# EAGLE schematic Esquema (EAGLE 9.2.2)
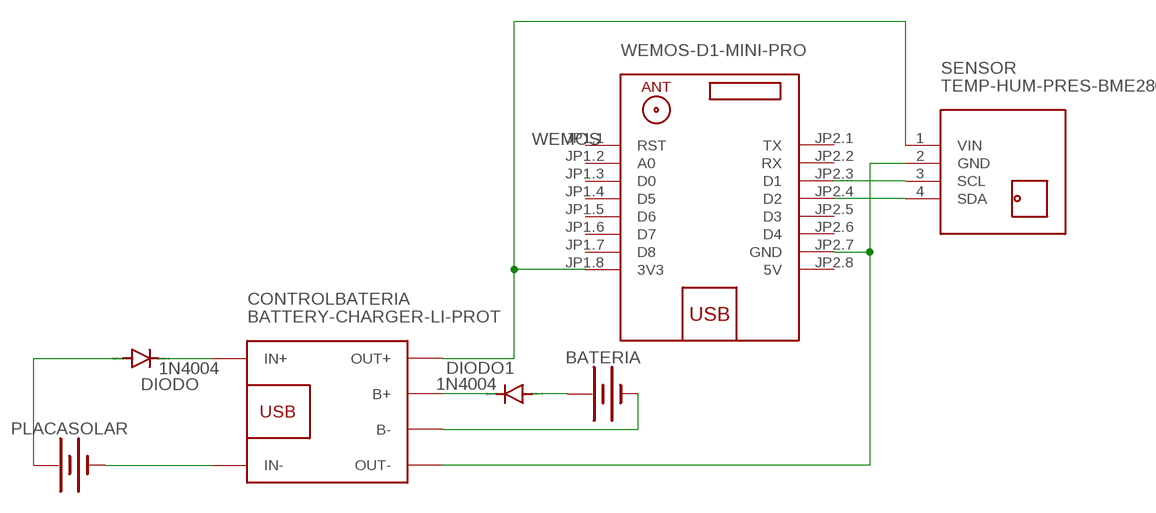
[diagram p0: schematic, sheet 1]

## Parts
BATERIA  BATTERY-18650  [BATTERY_18650-HOLDER]
CONTROLBATERIA  BATTERY-CHARGER-LI-PROT  [BATTERY-CHARGER-LI-PROT]
DIODO  1N4004  [DO41-10]
DIODO1  1N4004  [DO41-10]
PLACASOLAR  BATTERY-20MM_SMD  [BATTCON_20MM]
SENSOR  TEMP-HUM-PRES-BME280  [TEMP-HUM-PRES-BME280]
WEMOS  WEMOS-D1-MINI-PRO  [WEMOS-D1-MINI-PRO]

## Nets
N$1: CONTROLBATERIA.OUT- SENSOR.2(GND) WEMOS.JP2.7(GND)
N$2: CONTROLBATERIA.IN+ DIODO.C
N$3: DIODO.A PLACASOLAR.1(+)
N$4: CONTROLBATERIA.IN- PLACASOLAR.2(-)
N$5: BATERIA.PWR@1(+) DIODO1.A
N$6: BATERIA.GND@1(-) CONTROLBATERIA.B-
N$7: CONTROLBATERIA.B+ DIODO1.C
N$8: CONTROLBATERIA.OUT+ SENSOR.1(VIN) WEMOS.JP1.8(3V3)
N$9: SENSOR.3(SCL) WEMOS.JP2.3(D1)
N$10: SENSOR.4(SDA) WEMOS.JP2.4(D2)
Unconnected: WEMOS.JP1.1(RST) WEMOS.JP1.2(A0) WEMOS.JP1.3(D0) WEMOS.JP1.4(D5) WEMOS.JP1.5(D6) WEMOS.JP1.6(D7) WEMOS.JP1.7(D8) WEMOS.JP2.1(TX) WEMOS.JP2.2(RX) WEMOS.JP2.5(D3) WEMOS.JP2.6(D4)

## Power pins joined to a net without a drawn wire
5V: WEMOS.JP2.8(5V)

## Library data of the parts
BATERIA = SparkFun-Batteries:BATTERY: Battery - Single Cell A variety of battery chemistries, sizes, and footprints. Device List: 20MM_PTH - Coin Cell Battery Holder - 20mm (PTH) <https://www.sparkfun.com/products/783> 6.8MM_PTH - Coin Cell Battery Holder - 6.8MM(SMD) <https://www.digikey.com/product-detail/en/seiko-instruments/MS621FE-FL11E/728-1057-ND/1889208?WT.srch=1&gclid=CNOQ5a6LzdQCFZS2wAodXCkE0g> 12MM_SMD - Coin Cell Battery Holder - 12mm (SMD) <https://www.sparkfun.com/products/10592> 12MM_PTH - Coin Cell Battery Holder - 12mm (PTH) <https://www.sparkfun.com/products/7948> 20MM_SMD - 20mm Coin Cell Battery Holder (SMD) (2 legs) Used on the Big Time Watch Kit <https://www.sparkfun.com/products/11734> 20MM_SMD_4LEGS - Coin Cell Battery Holder - 20mm (SMD) <https://www.sparkfun.com/products/11892> 20MM_SMD_4LEGS_OVERPASTE - Coin Cell Battery Holder - 20mm (SMD) <https://www.sparkfun.com/products/11892> (Over-paste on the legs) 24.5MM_PTH - Coin Cell Battery Holder - 24.5mm (PTH) <https://www.sparkfun.com/products/8863> 9V - 9V Battery Holder - PC Mount Used on the SparkFun SparkPunk Sound Kit <https://www.sparkfun.com/products/11177> and SparkFun SparkPunk Sequencer Kit <https://www.sparkfun.com/products/12707> 18650 - Battery Holder - 18650 (PTH) <https://www.sparkfun.com/products/13113> AA - Battery Holder - 1xAA (PTH) <https://www.sparkfun.com/products/7949> AAA - Battery Holder - 1xAAA (PTH) <https://www.sparkfun.com/products/12718> AA_KIT - Battery Holder - 1xAA (PTH) <https://www.sparkfun.com/products/7949> Special kit package - pads only have exposed copper on one side of the board. AAA_KIT - Battery Holder - 1xAAA (PTH) <https://www.sparkfun.com/products/12718> Special kit package - pads only have exposed copper on one side of the board.; PROD_ID: BATT-12327; SF_SKU: PRT-13113
CONTROLBATERIA = diy-modules:BATTERY-CHARGER-LI-PROT: Lithium Battery 5V Charger with protection circuit More details available here: http://www.instructables.com/id/DIY-Lithium-ion-Battery-Charger/step4/TP4056-based-lithium-ion-battery-charger-module/ Click here to find device on ebay.com <http://www.ebay.com/sch/tp4056+charger+usb+protection>
DIODO DIODO1 = diode:1N4004: DIODE general purpose rectifier, 1 A
PLACASOLAR = SparkFun-Batteries:BATTERY: Battery - Single Cell A variety of battery chemistries, sizes, and footprints. Device List: 20MM_PTH - Coin Cell Battery Holder - 20mm (PTH) <https://www.sparkfun.com/products/783> 6.8MM_PTH - Coin Cell Battery Holder - 6.8MM(SMD) <https://www.digikey.com/product-detail/en/seiko-instruments/MS621FE-FL11E/728-1057-ND/1889208?WT.srch=1&gclid=CNOQ5a6LzdQCFZS2wAodXCkE0g> 12MM_SMD - Coin Cell Battery Holder - 12mm (SMD) <https://www.sparkfun.com/products/10592> 12MM_PTH - Coin Cell Battery Holder - 12mm (PTH) <https://www.sparkfun.com/products/7948> 20MM_SMD - 20mm Coin Cell Battery Holder (SMD) (2 legs) Used on the Big Time Watch Kit <https://www.sparkfun.com/products/11734> 20MM_SMD_4LEGS - Coin Cell Battery Holder - 20mm (SMD) <https://www.sparkfun.com/products/11892> 20MM_SMD_4LEGS_OVERPASTE - Coin Cell Battery Holder - 20mm (SMD) <https://www.sparkfun.com/products/11892> (Over-paste on the legs) 24.5MM_PTH - Coin Cell Battery Holder - 24.5mm (PTH) <https://www.sparkfun.com/products/8863> 9V - 9V Battery Holder - PC Mount Used on the SparkFun SparkPunk Sound Kit <https://www.sparkfun.com/products/11177> and SparkFun SparkPunk Sequencer Kit <https://www.sparkfun.com/products/12707> 18650 - Battery Holder - 18650 (PTH) <https://www.sparkfun.com/products/13113> AA - Battery Holder - 1xAA (PTH) <https://www.sparkfun.com/products/7949> AAA - Battery Holder - 1xAAA (PTH) <https://www.sparkfun.com/products/12718> AA_KIT - Battery Holder - 1xAA (PTH) <https://www.sparkfun.com/products/7949> Special kit package - pads only have exposed copper on one side of the board. AAA_KIT - Battery Holder - 1xAAA (PTH) <https://www.sparkfun.com/products/12718> Special kit package - pads only have exposed copper on one side of the board.; PROD_ID: BATT-11519
SENSOR = diy-modules:TEMP-HUM-PRES-BME280: Digital Humidity-Temperature-Pressure Sensor based on BME280 device More information about BME280 device is available here: https://www.bosch-sensortec.com/bst/products/all_products/bme280 Click here to find device on ebay.com <http://www.ebay.com/sch/bme280+breakout>
WEMOS = diy-modules:WEMOS-D1-MINI-PRO: WEMOS D1 mini Pro: Mini Wi-Fi Board based on ESP-8266EX chip More details can be found here: https://www.wemos.cc/product/d1-mini-pro.html Click here to find device on ebay.com <http://www.ebay.com/sch/wemos+d1+mini+pro>; SPICEPREFIX: X